# Altium project CR-10 Motherboard.PrjPcb
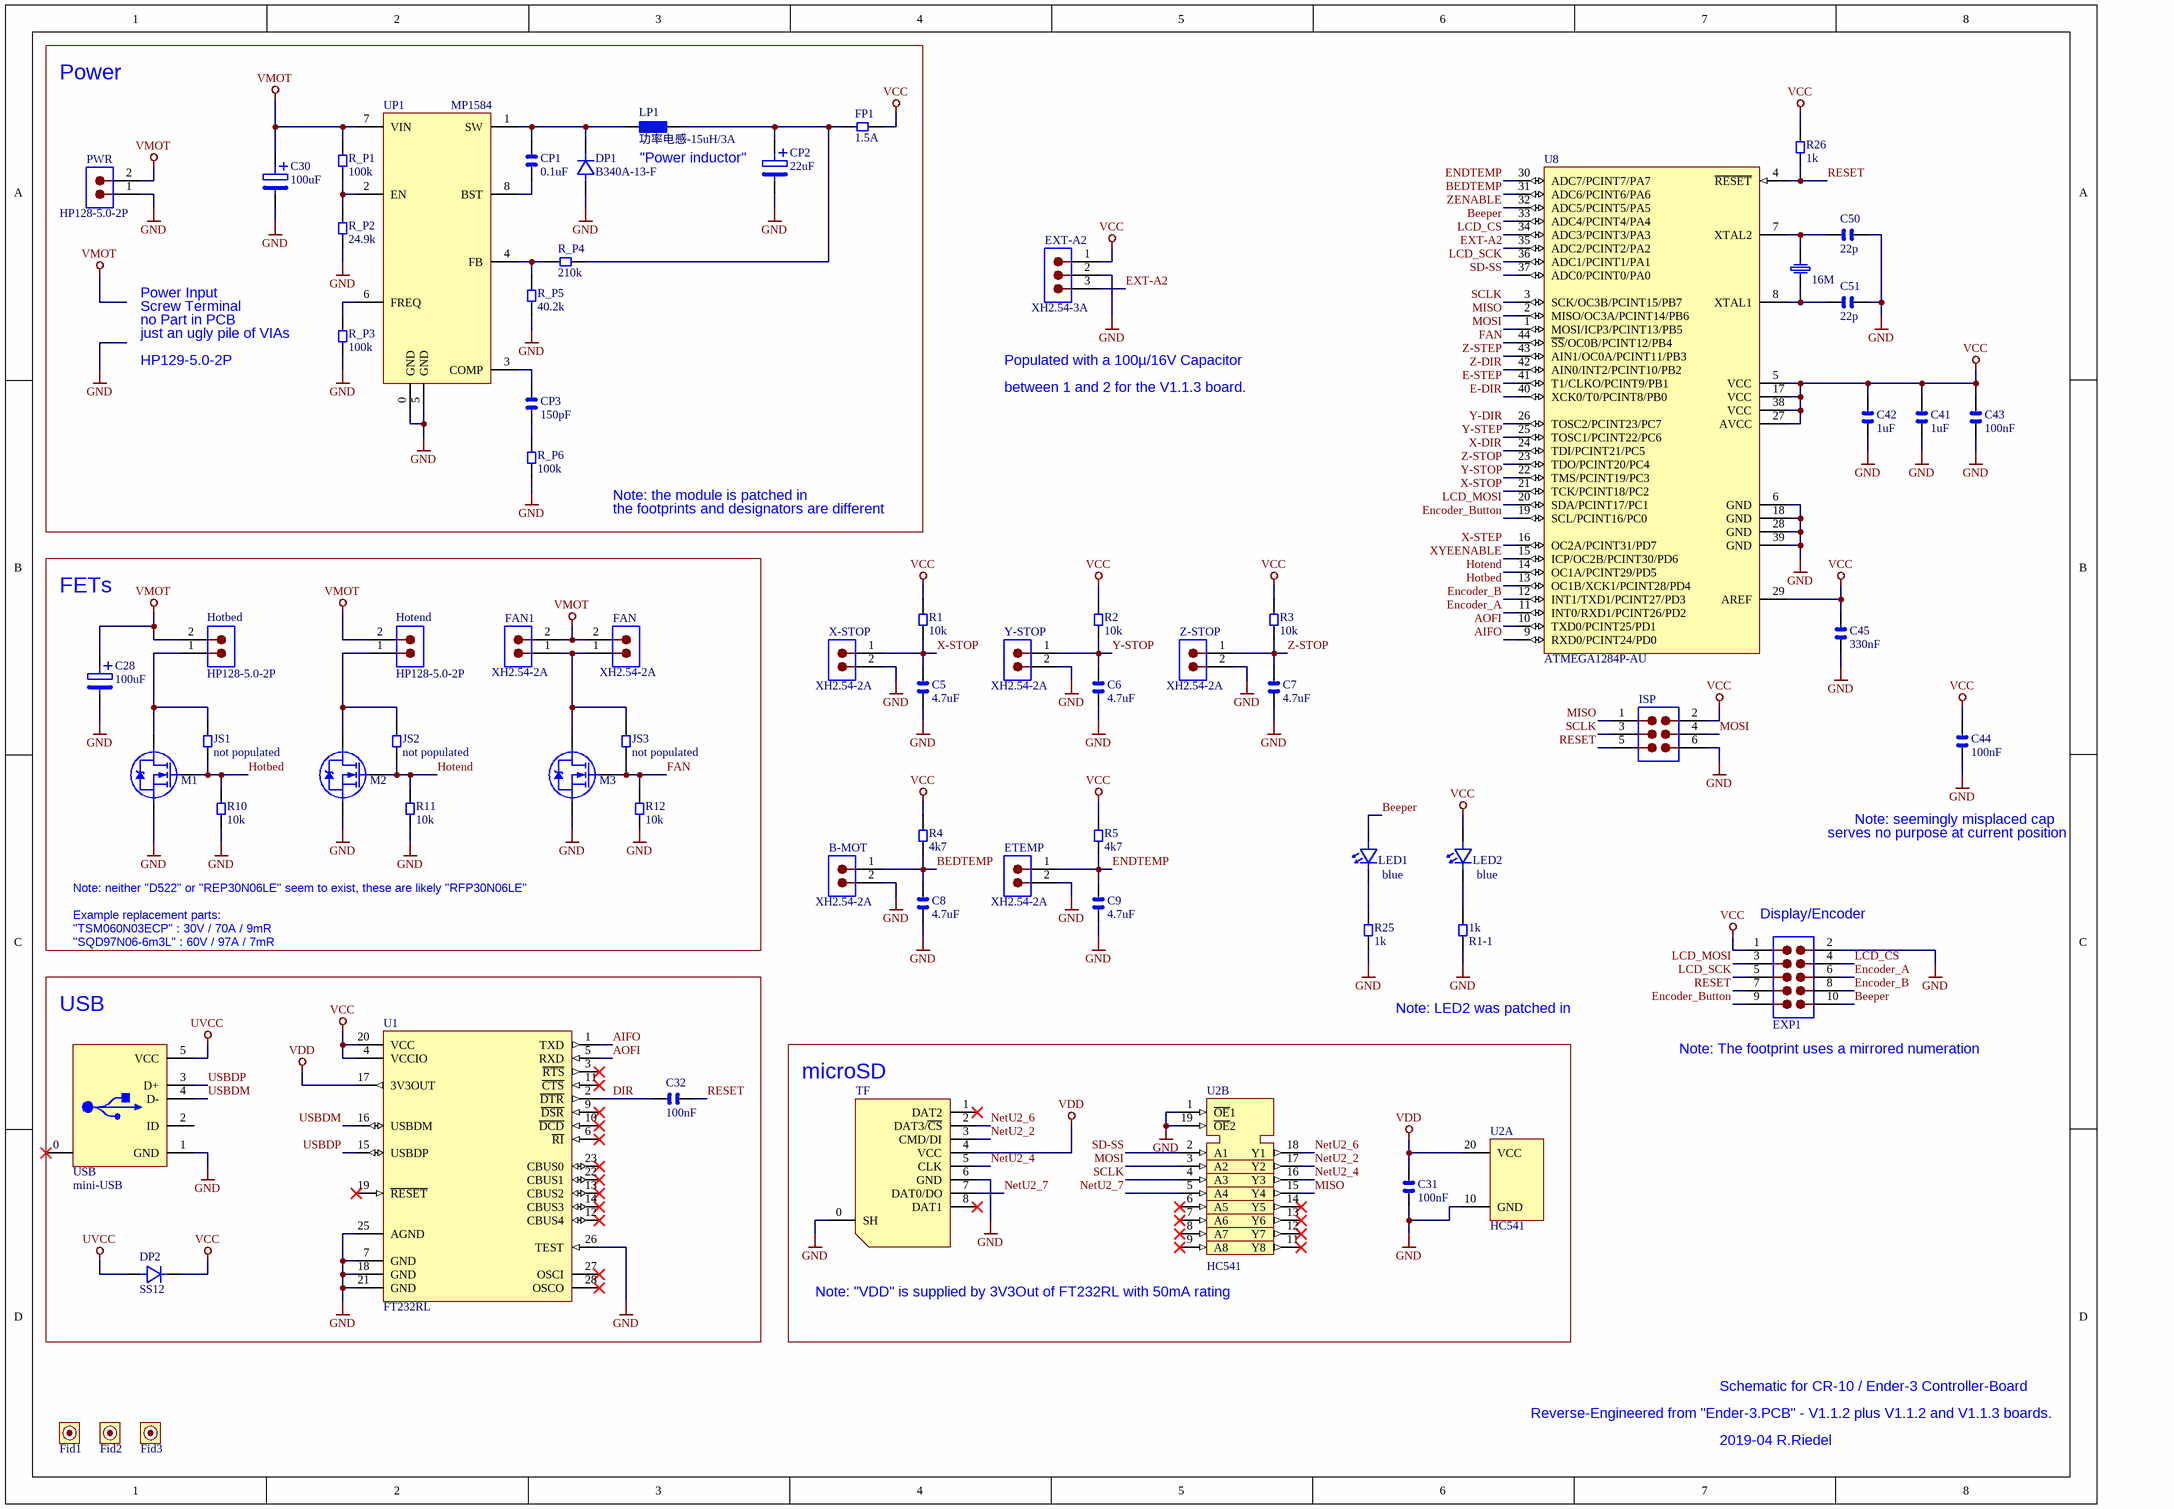
[diagram p0: CR-10 Motherboard_1.SchDoc]
Abteilung: VD-D3.2 Hardware-Labor; Aenderung_de: In diesem Dokument enthaltene Informationen koennen ohne Vorankuendigung geaendert werden.; Aenderung_en: The information in this document is subject to change without notice.; Copyright: Copyright IAV GmbH www.iav.com , www.iavinc.com; Firma_kurz: IAV GmbH; Firma_lang: Ingenieurgesellschaft fuer Auto und Verkehr; Kategorie: IAV-L; Platinenname: Hauptkarte; PlatineNummer: 01; ProjektNummer: xxxx; Projektschaltplan_freigegeben: X2.XX.XXXX; Projektschaltplan_geprueft: X1.XX.XXXX; Projektschaltplanbearbeiter: R.Riedel; Projektschaltplanfreigeber: tbd2; Projektschaltplanpruefer: tbd1; ProjektschaltplanRevision: 01; ReleaseNummer: 01; Schutzvermerk_de: Vertraulich, nur interner Gebrauch. Verwendung ausserhalb IAV nur mit Geheimhaltungsvereinbarung. Schutzvermerk ISO 16016 beachten.; Schutzvermerk_en: Confidential, for internal use only. Use outside of IAV only with confidentiality obligation. Refer to protection notice ISO 16016.
2 sheets, 147 parts. Net scope: global (net labels, ports and power ports of the same name join across sheets).
Board file: CR-10 Motherboard.PcbDoc
Sheets:
  CR-10 Motherboard_1.SchDoc
  CR-10 Motherboard_2.SchDoc

## Sheet CR-10 Motherboard_1.SchDoc: Sheet Description
size A3; Organization: Organization; Address1: Address1; Address2: Address2; Address3: Address3; Address4: Address4; DocumentNumber: 1; Revision: 0; SheetNumber: 1; SheetTotal: 2; PageSetup: Record=PageOptions|CenterHorizontal=True|CenterVertical=True|PrintScale=1.00|XCorrection=1.00|YCorrection=1.00|PrintKind=1|BorderSize=5000000|LeftOffset=0|BottomOffset=0|Orientation=2|PaperLength=1000|PaperWidth=1000|Scale=100|PaperSource=7|PrintQuality=-4|MediaType=1|DitherType=10|PaperKind=A3|PrintScaleMode=0

### Parts
1k  R1-1  [0603]
16M  16Mhz  [CRY]  (value not drawn)
B-MOT  XH2.54-2A  [P2]
C5  4.7uF  [0805]
C6  4.7uF  [0805]
C7  4.7uF  [0805]
C8  4.7uF  [0805]
C9  4.7uF  [0805]
C28  100uF  [CAP-100]
C30  100uF  [CAP-100]
C31  100nF  [0805]
C32  100nF  [0603]
C41  1uF  [0603]
C42  1uF  [0603]
C43  100nF  [0603]
C44  100nF  [0603]
C45  330nF  [0603]
C50  22p  [0603]
C51  22p  [0603]
CP1  0.1uF  [C0603]
CP2  22uF  [RVT4X5.5]
CP3  150pF  [C0603]
DP1  B340A-13-F  [D-SMA]
DP2  SS12  [D-SMA]
ETEMP  XH2.54-2A  [P2]
EXP1  Header 2x5  [SOP10]  (value not drawn)
EXT-A2  XH2.54-3A  [XH-3A]
FAN  XH2.54-2A  [P2]
FAN1  XH2.54-2A  [P2]
Fid1  Fiducial  [Fiducial-A]  (value not drawn)
Fid2  Fiducial  [Fiducial-A]  (value not drawn)
Fid3  Fiducial  [Fiducial-A]  (value not drawn)
FP1  1.5A  [MF-MSMF050]
Hotbed  HP128-5.0-2P  [MOT-2]
Hotend  HP128-5.0-2P  [MOT-2]
ISP  HEADER 3X2  (value not drawn)
JS1  not populated  [R10]
JS2  not populated  [R10]
JS3  not populated  [R10]
LED1  blue  [0603]
LED2  blue  [0603]
LP1  功率电感-15uH/3A  [DO3316P]
M1  REP30N06LE  [TO-252]  (value not drawn)
M2  REP30N06LE  [TO-252]  (value not drawn)
M3  REP30N06LE  [TO-252]  (value not drawn)
PWR  HP128-5.0-2P  [MOT-2]
R1  10k  [0603]
R2  10k  [0603]
R3  10k  [0603]
R4  4k7  [0603]
R5  4k7  [0603]
R10  10k  [0603]
R11  10k  [0603]
R12  10k  [0603]
R25  1k  [0603]
R26  1k  [0603]
R_P1  100k  [R0603]
R_P2  24.9k  [R0603]
R_P3  100k  [R0603]
R_P4  210k  [R0603]
R_P5  40.2k  [R0603]
R_P6  100k  [R0603]
TF  TF  [TF]  (value not drawn)
U1  FT232RL  [PL2303]
U2  HC541  [SSOP-20]  (parts A,B of 2)
U8  ATMEGA1284P-AU  [QFP-44]
UP1  MP1584  [SOIC8E]
USB  mini-USB  [USB]
X-STOP  XH2.54-2A  [P2]
Y-STOP  XH2.54-2A  [P2]
Z-STOP  XH2.54-2A  [P2]

### Blocks framed on the sheet
Power: C30 CP1-CP3 DP1 FP1 LP1 PWR R_P1-R_P6 UP1
FETs: C28 FAN FAN1 Hotbed Hotend JS1-JS3 M1-M3 R10-R12
USB: C32 DP2 U1 USB
microSD: C31 TF U2

### Nets
GND: 1k.2 B-MOT.2 C5.2 C6.2 C7.2 C8.2 C9.2 C28.2 C30.2 C31.2 C41.2 C42.2 C43.2 C44.2 C45.2 C50.2 C51.2 CP2.2 DP1.1 ETEMP.2 EXP1.2 EXT-A2.2 ISP.6 M1.3(S) M2.3(S) M3.3(S) PWR.1 R10.2 R11.2 R12.2 R25.2 R_P2.2 R_P3.2 R_P5.2 R_P6.2 TF.0(SH) TF.6(GND) U1.7(GND) U1.18(GND) U1.21(GND) U1.25(AGND) U1.26(TEST) U2.1(~{OE}1) U2.10(GND) U2.19(~{OE}2) U8.6(GND) U8.18(GND) U8.28(GND) U8.39(GND) UP1.0(GND) UP1.5(GND) USB.1(GND) X-STOP.2 Y-STOP.2 Z-STOP.2
UVCC: DP2.1 USB.5(VCC)
VCC: C41.1 C42.1 C43.1 C44.1 C45.1 DP2.2 EXP1.1 EXT-A2.1 FP1.2 ISP.2 LED2.2 R1.2 R2.2 R3.2 R4.2 R5.2 R26.2 U1.4(VCCIO) U1.20(VCC) U8.5(VCC) U8.17(VCC) U8.27(AVCC) U8.29(AREF) U8.38(VCC)
VDD: C31.1 TF.4(VCC) U1.17(3V3OUT) U2.20(VCC)
VMOT: C28.1 C30.1 FAN.2 FAN1.2 Hotbed.2 Hotend.2 PWR.2 R_P1.1 UP1.7(VIN)
AIFO: U1.1(TXD) U8.9(RXD0/PCINT24/PD0)
AOFI: U1.5(RXD) U8.10(TXD0/PCINT25/PD1)
BEDTEMP: B-MOT.1 C8.1 R4.1 U8.31(ADC6/PCINT6/PA6)
Beeper: EXP1.10 LED1.1 U8.33(ADC4/PCINT4/PA4)
DIR: C32.1 U1.2(~{DTR})
E-DIR: U8.40(XCK0/T0/PCINT8/PB0)
E-STEP: U8.41(T1/CLKO/PCINT9/PB1)
Encoder_A: EXP1.6 U8.11(INT0/RXD1/PCINT26/PD2)
Encoder_B: EXP1.8 U8.12(INT1/TXD1/PCINT27/PD3)
Encoder_Button: EXP1.9 U8.19(SCL/PCINT16/PC0)
ENDTEMP: C9.1 ETEMP.1 R5.1 U8.30(ADC7/PCINT7/PA7)
EXT-A2: EXT-A2.3 U8.35(ADC2/PCINT2/PA2)
FAN: JS3.1 M3.1(G) R12.1 U8.44(~{SS}/OC0B/PCINT12/PB4)
Hotbed: JS1.1 M1.1(G) R10.1 U8.13(OC1B/XCK1/PCINT28/PD4)
Hotend: JS2.1 M2.1(G) R11.1 U8.14(OC1A/PCINT29/PD5)
LCD_CS: EXP1.4 U8.34(ADC3/PCINT3/PA3)
LCD_MOSI: EXP1.3 U8.20(SDA/PCINT17/PC1)
LCD_SCK: EXP1.5 U8.36(ADC1/PCINT1/PA1)
MISO: ISP.1 U2.15(Y4) U8.2(MISO/OC3A/PCINT14/PB6)
MOSI: ISP.4 U2.3(A2) U8.1(MOSI/ICP3/PCINT13/PB5)
NetU2_2: TF.3(CMD/DI) U2.17(Y2)
NetU2_4: TF.5(CLK) U2.16(Y3)
NetU2_6: TF.2(DAT3/~{CS}) U2.18(Y1)
NetU2_7: TF.7(DAT0/DO) U2.5(A4)
RESET: C32.2 EXP1.7 ISP.5 R26.1 U8.4(~{RESET})
SCLK: ISP.3 U2.4(A3) U8.3(SCK/OC3B/PCINT15/PB7)
SD-SS: U2.2(A1) U8.37(ADC0/PCINT0/PA0)
USBDM: U1.16(USBDM) USB.4(D-)
USBDP: U1.15(USBDP) USB.3(D+)
X-DIR: U8.24(TDI/PCINT21/PC5)
X-STEP: U8.16(OC2A/PCINT31/PD7)
X-STOP: C5.1 R1.1 U8.21(TCK/PCINT18/PC2) X-STOP.1
XYEENABLE: U8.15(ICP/OC2B/PCINT30/PD6)
Y-DIR: U8.26(TOSC2/PCINT23/PC7)
Y-STEP: U8.25(TOSC1/PCINT22/PC6)
Y-STOP: C6.1 R2.1 U8.22(TMS/PCINT19/PC3) Y-STOP.1
Z-DIR: U8.42(AIN0/INT2/PCINT10/PB2)
Z-STEP: U8.43(AIN1/OC0A/PCINT11/PB3)
Z-STOP: C7.1 R3.1 U8.23(TDO/PCINT20/PC4) Z-STOP.1
ZENABLE: U8.32(ADC5/PCINT5/PA5)
Net1k_1: 1k.1 LED2.1
Net16M_1: 16M.1 C50.1 U8.7(XTAL2)
Net16M_2: 16M.2 C51.1 U8.8(XTAL1)
NetCP1_1: CP1.1 UP1.8(BST)
NetCP1_2: CP1.2 DP1.2 LP1.2 UP1.1(SW)
NetCP2_1: CP2.1 FP1.1 LP1.1 R_P4.2
NetCP3_1: CP3.1 R_P6.1
NetCP3_2: CP3.2 UP1.3(COMP)
NetFAN_1: FAN.1 FAN1.1 JS3.2 M3.2(D)
NetHotbed_1: Hotbed.1 JS1.2 M1.2(D)
NetHotend_1: Hotend.1 JS2.2 M2.2(D)
NetLED1_2: LED1.2 R25.1
NetR_P1_2: R_P1.2 R_P2.1 UP1.2(EN)
NetR_P3_1: R_P3.1 UP1.6(FREQ)
NetR_P4_1: R_P4.1 R_P5.1 UP1.4(FB)

Not connected (* = marked no-connect by the designer): TF 1(DAT2)* 8(DAT1)*; U1 3(~{RTS})* 6(~{RI})* 9(~{DSR})* 10(~{DCD})* 11(~{CTS})* 12(CBUS4)* 13(CBUS2)* 14(CBUS3)* 19(~{RESET})* 22(CBUS1)* 23(CBUS0)* 27(OSCI)* 28(OSCO)*; U2 6(A5)* 7(A6)* 8(A7)* 9(A8)* 11(Y8)* 12(Y7)* 13(Y6)* 14(Y5)*; USB 0(SH)* 2(ID)

### Notes on the sheet
- "Power inductor"
- Screw Terminal
- Power Input
- no Part in PCB
- (near R_P3) just an ugly pile of VIAs
- HP129-5.0-2P
- Populated with a 100µ/16V Capacitor
- between 1 and 2 for the V1.1.3 board.
- Note: the module is patched in
- the footprints and designators are different
- serves no purpose at current position
- Note: seemingly misplaced cap
- Note: neither "D522" or "REP30N06LE" seem to exist, these are likely "RFP30N06LE"
- Example replacement parts:
- (near EXP1) Display/Encoder
- "TSM060N03ECP" : 30V / 70A / 9mR
- "SQD97N06-6m3L" : 60V / 97A / 7mR
- Note: LED2 was patched in
- (near EXP1) Note: The footprint uses a mirrored numeration
- (near U2) Note: "VDD" is supplied by 3V3Out of FT232RL with 50mA rating
- Schematic for CR-10 / Ender-3 Controller-Board
- Reverse-Engineered from "Ender-3.PCB" - V1.1.2 plus V1.1.2 and V1.1.3 boards.
- 2019-04 R.Riedel

### Library data of the parts
1k JS1-JS3 R10-R12 R25 R26 R_P1 R_P3-R_P6 = Resistor: 0603 Chip Resistor
16M = Crystal: Crystal HC49/US
B-MOT ETEMP FAN FAN1 X-STOP Y-STOP Z-STOP = Header 1x2
C5-C9 = CAP_2_V2: 0805 Chip Capacitor
C28 C30 CP2 = Capacitor Pol: Capacitor Polarized
C31 C32 C41-C45 C50 C51 = Capacitor: 0805 Chip Capacitor
CP1 CP3 = Capacitor: Chip Capacitor
DP1 DP2 = Diode_A1_K2: Diode
EXT-A2 = Header 1x3
FP1 R_P2 = Resistor: Chip Resistor
Hotbed Hotend PWR = Header 1x2: Terminal 1x2
ISP = Header 2x3
LED1 = LED_A1C2: LED
LED2 = LED_C1A2: LED
LP1 = Inductor
M1-M3 = N-FET
R1-R5 = RES_2_V2: 0603 Chip Resistor
TF = microSD
U1 = FT232RL: FTDI USB UART I.C.
U2 = 74HC541: 74HC541 - Octal buffer/line driver
U8 = ATmegaxx4PA-xx: AVR 8-Bit, 128k FLASH, TQFP44; Part Number: ATmega1284P-AU; PackageDescription: TQFP44
USB = USB

## Sheet CR-10 Motherboard_2.SchDoc: Sheet Description
size A3; Organization: Organization; Address1: Address1; Address2: Address2; Address3: Address3; Address4: Address4; DocumentNumber: 2; Revision: 0; SheetNumber: 2; SheetTotal: 2; PageSetup: Record=PageOptions|CenterHorizontal=True|CenterVertical=True|PrintScale=1.00|XCorrection=1.00|YCorrection=1.00|PrintKind=1|BorderSize=5000000|LeftOffset=0|BottomOffset=0|Orientation=2|PaperLength=1000|PaperWidth=1000|Scale=100|PaperSource=7|PrintQuality=-4|MediaType=1|DitherType=10|PaperKind=A3|PrintScaleMode=0
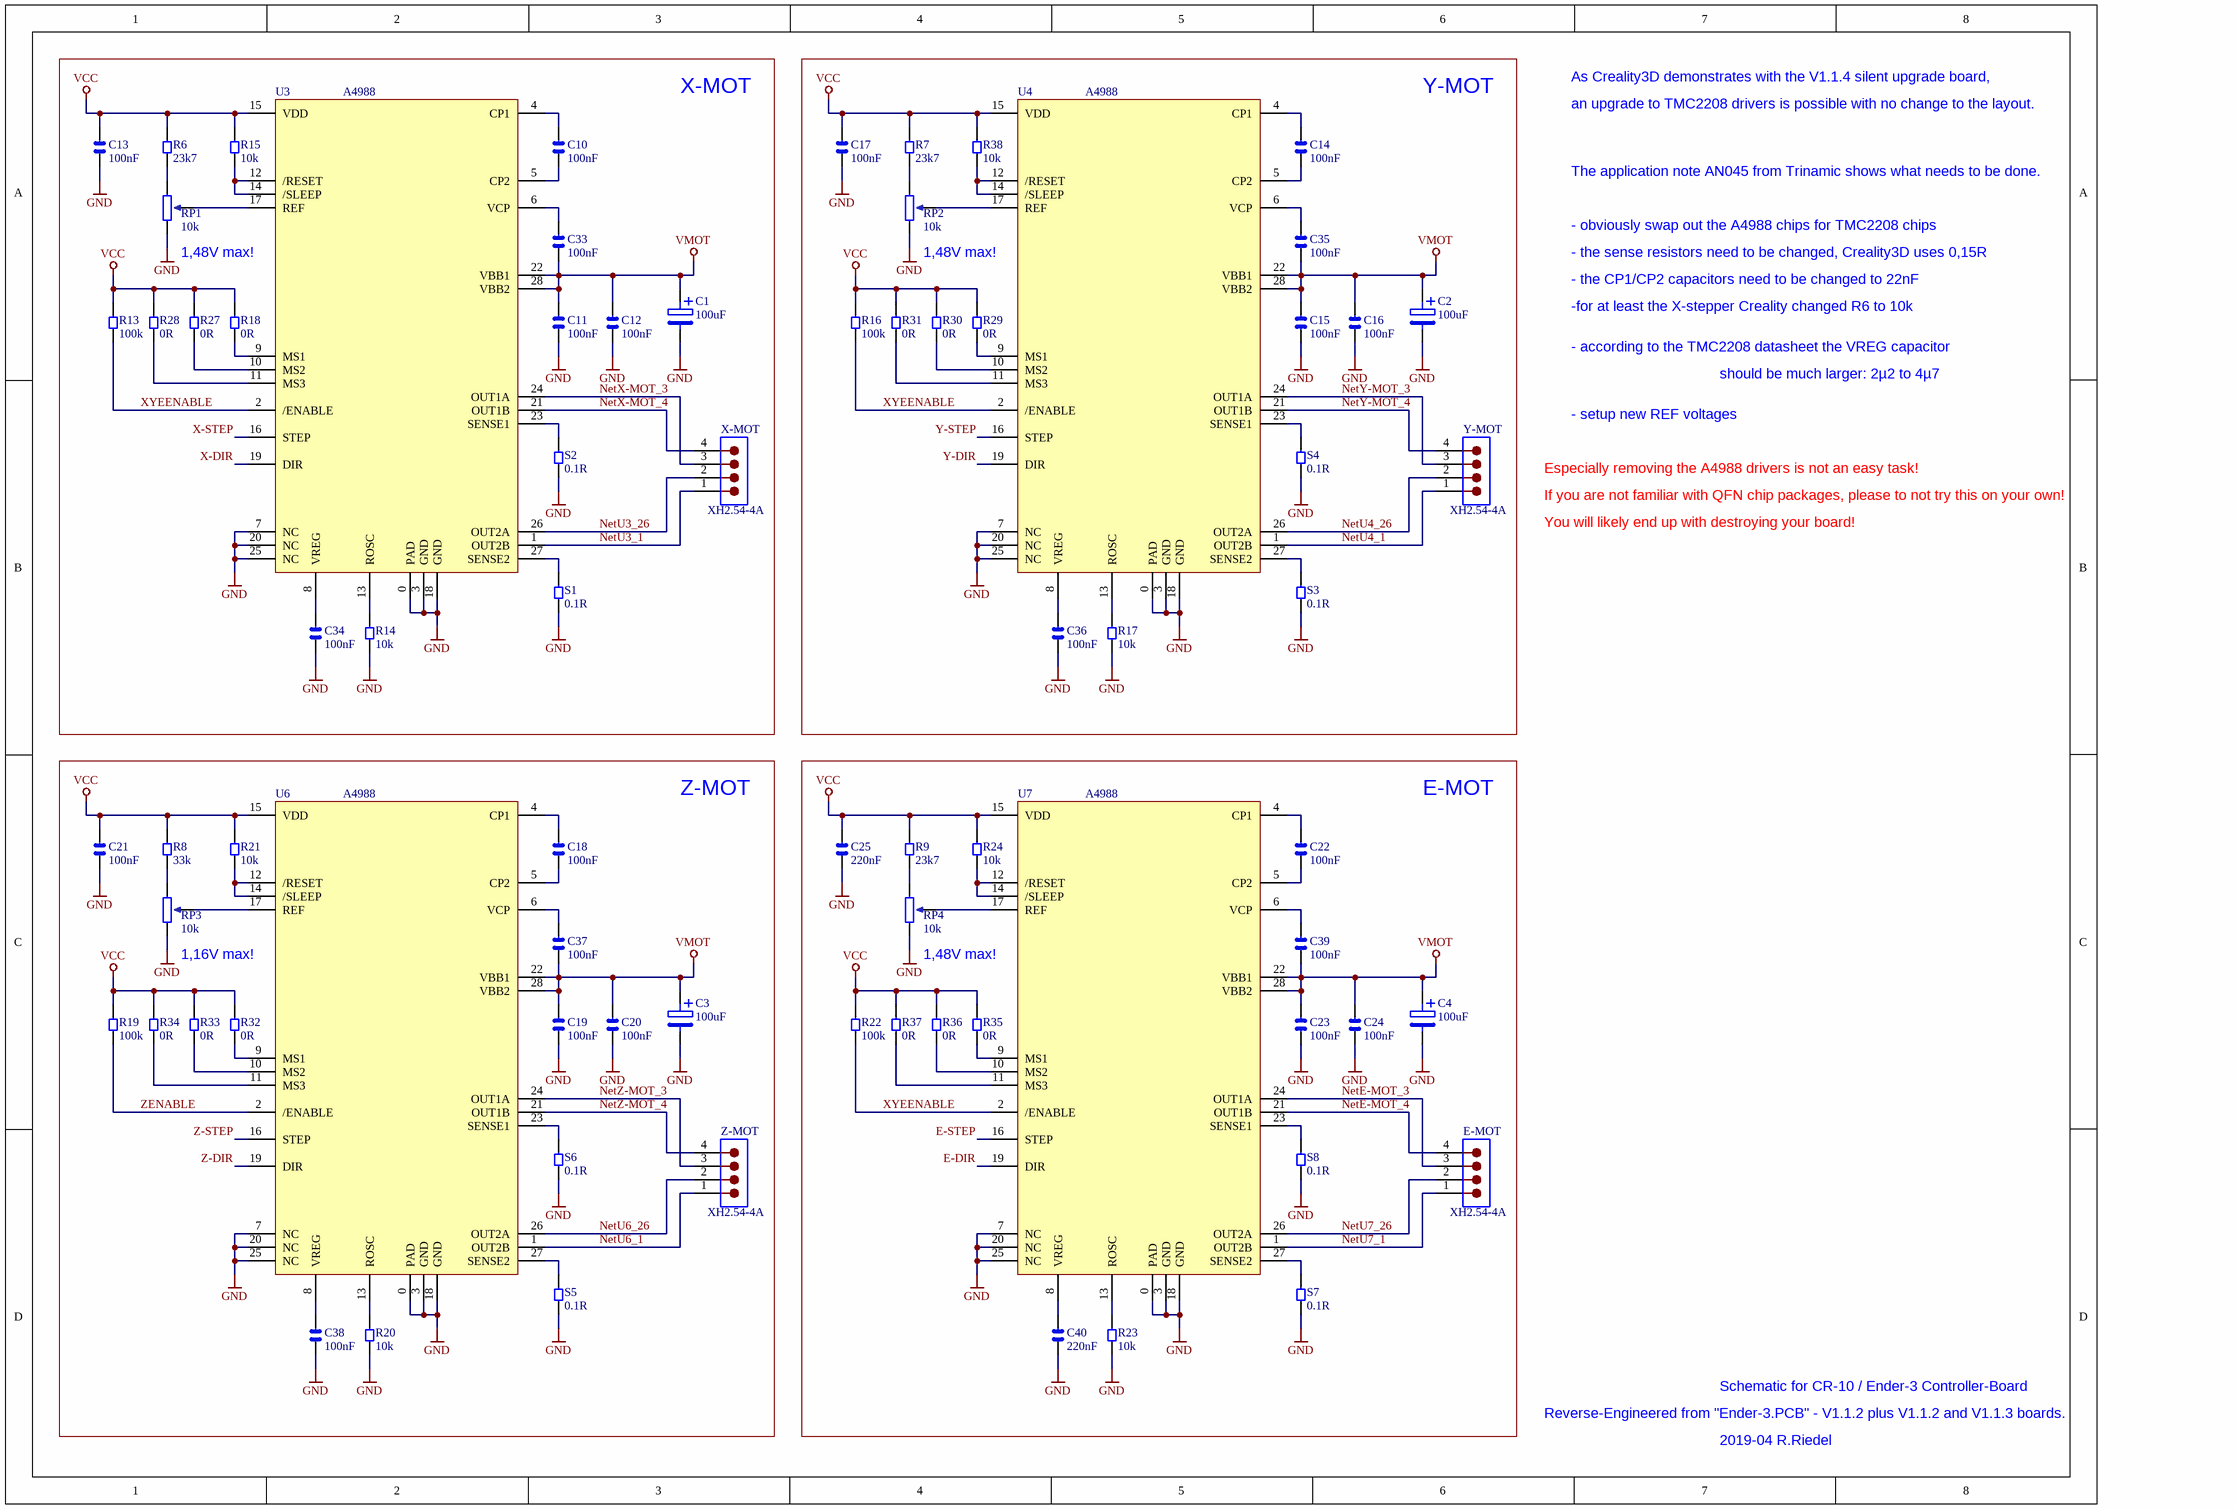
[diagram p1: CR-10 Motherboard_2.SchDoc]

### Parts
C1  100uF  [CAP-100]
C2  100uF  [CAP-100]
C3  100uF  [CAP-100]
C4  100uF  [CAP-100]
C10  100nF  [0603]
C11  100nF  [0603]
C12  100nF  [0603]
C13  100nF  [0603]
C14  100nF  [0603]
C15  100nF  [0603]
C16  100nF  [0603]
C17  100nF  [0603]
C18  100nF  [0603]
C19  100nF  [0603]
C20  100nF  [0603]
C21  100nF  [0603]
C22  100nF  [0603]
C23  100nF  [0603]
C24  100nF  [0603]
C25  220nF  [0603]
C33  100nF  [0603]
C34  100nF  [0603]
C35  100nF  [0603]
C36  100nF  [0603]
C37  100nF  [0603]
C38  100nF  [0603]
C39  100nF  [0603]
C40  220nF  [0603]
E-MOT  XH2.54-4A  [P4]
R6  23k7  [0603]
R7  23k7  [0603]
R8  33k  [0603]
R9  23k7  [0603]
R13  100k  [0603]
R14  10k  [0603]
R15  10k  [0603]
R16  100k  [0603]
R17  10k  [0603]
R18  0R  [0603]
R19  100k  [0603]
R20  10k  [0603]
R21  10k  [0603]
R22  100k  [0603]
R23  10k  [0603]
R24  10k  [0603]
R27  0R  [0603]
R28  0R  [0603]
R29  0R  [0603]
R30  0R  [0603]
R31  0R  [0603]
R32  0R  [0603]
R33  0R  [0603]
R34  0R  [0603]
R35  0R  [0603]
R36  0R  [0603]
R37  0R  [0603]
R38  10k  [0603]
RP1  10k  [RP]
RP2  10k  [RP]
RP3  10k  [RP]
RP4  10k  [RP]
S1  0.1R  [R100]
S2  0.1R  [R100]
S3  0.1R  [R100]
S4  0.1R  [R100]
S5  0.1R  [R100]
S6  0.1R  [R100]
S7  0.1R  [R100]
S8  0.1R  [R100]
U3  A4988  [QFP28]
U4  A4988  [QFP28]
U6  A4988  [QFP28]
U7  A4988  [QFP28]
X-MOT  XH2.54-4A  [P4]
Y-MOT  XH2.54-4A  [P4]
Z-MOT  XH2.54-4A  [P4]

### Blocks framed on the sheet
X-MOT: C1 C10-C13 C33 C34 R6 R13-R15 R18 R27 R28 RP1 S1 S2 U3 X-MOT
Y-MOT: C2 C14-C17 C35 C36 R7 R16 R17 R29-R31 R38 RP2 S3 S4 U4 Y-MOT
Z-MOT: C3 C18-C21 C37 C38 R8 R19-R21 R32-R34 RP3 S5 S6 U6 Z-MOT
E-MOT: C4 C22-C25 C39 C40 E-MOT R9 R22-R24 R35-R37 RP4 S7 S8 U7

### Nets
GND: C1.2 C2.2 C3.2 C4.2 C11.1 C12.2 C13.2 C15.1 C16.2 C17.2 C19.1 C20.2 C21.2 C23.1 C24.2 C25.2 C34.2 C36.2 C38.2 C40.2 R14.2 R17.2 R20.2 R23.2 RP1.2 RP2.2 RP3.2 RP4.2 S1.2 S2.2 S3.2 S4.2 S5.2 S6.2 S7.2 S8.2 U3.0(PAD) U3.3(GND) U3.7(NC) U3.18(GND) U3.20(NC) U3.25(NC) U4.0(PAD) U4.3(GND) U4.7(NC) U4.18(GND) U4.20(NC) U4.25(NC) U6.0(PAD) U6.3(GND) U6.7(NC) U6.18(GND) U6.20(NC) U6.25(NC) U7.0(PAD) U7.3(GND) U7.7(NC) U7.18(GND) U7.20(NC) U7.25(NC)
VCC: C13.1 C17.1 C21.1 C25.1 R6.2 R7.2 R8.2 R9.2 R13.2 R15.2 R16.2 R18.2 R19.2 R21.2 R22.2 R24.2 R27.2 R28.2 R29.2 R30.2 R31.2 R32.2 R33.2 R34.2 R35.2 R36.2 R37.2 R38.2 U3.15(VDD) U4.15(VDD) U6.15(VDD) U7.15(VDD)
VMOT: C1.1 C2.1 C3.1 C4.1 C11.2 C12.1 C15.2 C16.1 C19.2 C20.1 C23.2 C24.1 C33.2 C35.2 C37.2 C39.2 U3.22(VBB1) U3.28(VBB2) U4.22(VBB1) U4.28(VBB2) U6.22(VBB1) U6.28(VBB2) U7.22(VBB1) U7.28(VBB2)
E-DIR: U7.19(DIR)
E-STEP: U7.16(STEP)
NetE-MOT_3: E-MOT.3 U7.24(OUT1A)
NetE-MOT_4: E-MOT.4 U7.21(OUT1B)
NetU3_1: U3.1(OUT2B) X-MOT.1
NetU3_26: U3.26(OUT2A) X-MOT.2
NetU4_1: U4.1(OUT2B) Y-MOT.1
NetU4_26: U4.26(OUT2A) Y-MOT.2
NetU6_1: U6.1(OUT2B) Z-MOT.1
NetU6_26: U6.26(OUT2A) Z-MOT.2
NetU7_1: E-MOT.1 U7.1(OUT2B)
NetU7_26: E-MOT.2 U7.26(OUT2A)
NetX-MOT_3: U3.24(OUT1A) X-MOT.3
NetX-MOT_4: U3.21(OUT1B) X-MOT.4
NetY-MOT_3: U4.24(OUT1A) Y-MOT.3
NetY-MOT_4: U4.21(OUT1B) Y-MOT.4
NetZ-MOT_3: U6.24(OUT1A) Z-MOT.3
NetZ-MOT_4: U6.21(OUT1B) Z-MOT.4
X-DIR: U3.19(DIR)
X-STEP: U3.16(STEP)
XYEENABLE: R13.1 R16.1 R22.1 U3.2(/ENABLE) U4.2(/ENABLE) U7.2(/ENABLE)
Y-DIR: U4.19(DIR)
Y-STEP: U4.16(STEP)
Z-DIR: U6.19(DIR)
Z-STEP: U6.16(STEP)
ZENABLE: R19.1 U6.2(/ENABLE)
NetC10_1: C10.1 U3.4(CP1)
NetC10_2: C10.2 U3.5(CP2)
NetC14_1: C14.1 U4.4(CP1)
NetC14_2: C14.2 U4.5(CP2)
NetC18_1: C18.1 U6.4(CP1)
NetC18_2: C18.2 U6.5(CP2)
NetC22_1: C22.1 U7.4(CP1)
NetC22_2: C22.2 U7.5(CP2)
NetC33_1: C33.1 U3.6(VCP)
NetC34_1: C34.1 U3.8(VREG)
NetC35_1: C35.1 U4.6(VCP)
NetC36_1: C36.1 U4.8(VREG)
NetC37_1: C37.1 U6.6(VCP)
NetC38_1: C38.1 U6.8(VREG)
NetC39_1: C39.1 U7.6(VCP)
NetC40_1: C40.1 U7.8(VREG)
NetR6_1: R6.1 RP1.3
NetR7_1: R7.1 RP2.3
NetR8_1: R8.1 RP3.3
NetR9_1: R9.1 RP4.3
NetR14_1: R14.1 U3.13(ROSC)
NetR15_1: R15.1 U3.12(/RESET) U3.14(/SLEEP)
NetR17_1: R17.1 U4.13(ROSC)
NetR18_1: R18.1 U3.9(MS1)
NetR20_1: R20.1 U6.13(ROSC)
NetR21_1: R21.1 U6.12(/RESET) U6.14(/SLEEP)
NetR23_1: R23.1 U7.13(ROSC)
NetR24_1: R24.1 U7.12(/RESET) U7.14(/SLEEP)
NetR27_1: R27.1 U3.10(MS2)
NetR28_1: R28.1 U3.11(MS3)
NetR29_1: R29.1 U4.9(MS1)
NetR30_1: R30.1 U4.10(MS2)
NetR31_1: R31.1 U4.11(MS3)
NetR32_1: R32.1 U6.9(MS1)
NetR33_1: R33.1 U6.10(MS2)
NetR34_1: R34.1 U6.11(MS3)
NetR35_1: R35.1 U7.9(MS1)
NetR36_1: R36.1 U7.10(MS2)
NetR37_1: R37.1 U7.11(MS3)
NetR38_1: R38.1 U4.12(/RESET) U4.14(/SLEEP)
NetRP1_1: RP1.1 U3.17(REF)
NetRP2_1: RP2.1 U4.17(REF)
NetRP3_1: RP3.1 U6.17(REF)
NetRP4_1: RP4.1 U7.17(REF)
NetS1_1: S1.1 U3.27(SENSE2)
NetS2_1: S2.1 U3.23(SENSE1)
NetS3_1: S3.1 U4.27(SENSE2)
NetS4_1: S4.1 U4.23(SENSE1)
NetS5_1: S5.1 U6.27(SENSE2)
NetS6_1: S6.1 U6.23(SENSE1)
NetS7_1: S7.1 U7.27(SENSE2)
NetS8_1: S8.1 U7.23(SENSE1)

### Notes on the sheet
- As Creality3D demonstrates with the V1.1.4 silent upgrade board,
- an upgrade to TMC2208 drivers is possible with no change to the layout.
- The application note AN045 from Trinamic shows what needs to be done.
- - obviously swap out the A4988 chips for TMC2208 chips
- 1,48V max!
- - the sense resistors need to be changed, Creality3D uses 0,15R
- - the CP1/CP2 capacitors need to be changed to 22nF
- -for at least the X-stepper Creality changed R6 to 10k
- - according to the TMC2208 datasheet the VREG capacitor
- should be much larger: 2µ2 to 4µ7
- - setup new REF voltages
- Especially removing the A4988 drivers is not an easy task!
- If you are not familiar with QFN chip packages, please to not try this on your own!
- You will likely end up with destroying your board!
- 1,16V max!
- Schematic for CR-10 / Ender-3 Controller-Board
- Reverse-Engineered from "Ender-3.PCB" - V1.1.2 plus V1.1.2 and V1.1.3 boards.
- 2019-04 R.Riedel

### Library data of the parts
C1-C4 = Capacitor Pol: Capacitor Polarized
C10-C25 C33-C40 = Capacitor: Chip Capacitor
E-MOT X-MOT Y-MOT Z-MOT = Header 1x4
R6-R9 R13-R24 R27-R38 S1-S8 = Resistor: Chip Resistor
RP1-RP4 = RTrimm

## Nets that join several sheets
GND: CR-10 Motherboard_1 (55 pins), CR-10 Motherboard_2 (60 pins)
VCC: CR-10 Motherboard_1 (24 pins), CR-10 Motherboard_2 (32 pins)
VMOT: CR-10 Motherboard_1 (9 pins), CR-10 Motherboard_2 (24 pins)
E-DIR: CR-10 Motherboard_1 (U8.40), CR-10 Motherboard_2 (U7.19)
E-STEP: CR-10 Motherboard_1 (U8.41), CR-10 Motherboard_2 (U7.16)
X-DIR: CR-10 Motherboard_1 (U8.24), CR-10 Motherboard_2 (U3.19)
X-STEP: CR-10 Motherboard_1 (U8.16), CR-10 Motherboard_2 (U3.16)
XYEENABLE: CR-10 Motherboard_1 (U8.15), CR-10 Motherboard_2 (6 pins)
Y-DIR: CR-10 Motherboard_1 (U8.26), CR-10 Motherboard_2 (U4.19)
Y-STEP: CR-10 Motherboard_1 (U8.25), CR-10 Motherboard_2 (U4.16)
Z-DIR: CR-10 Motherboard_1 (U8.42), CR-10 Motherboard_2 (U6.19)
Z-STEP: CR-10 Motherboard_1 (U8.43), CR-10 Motherboard_2 (U6.16)
ZENABLE: CR-10 Motherboard_1 (U8.32), CR-10 Motherboard_2 (R19.1 U6.2)